# EAGLE design PCB3 (EAGLE 8.0.1)
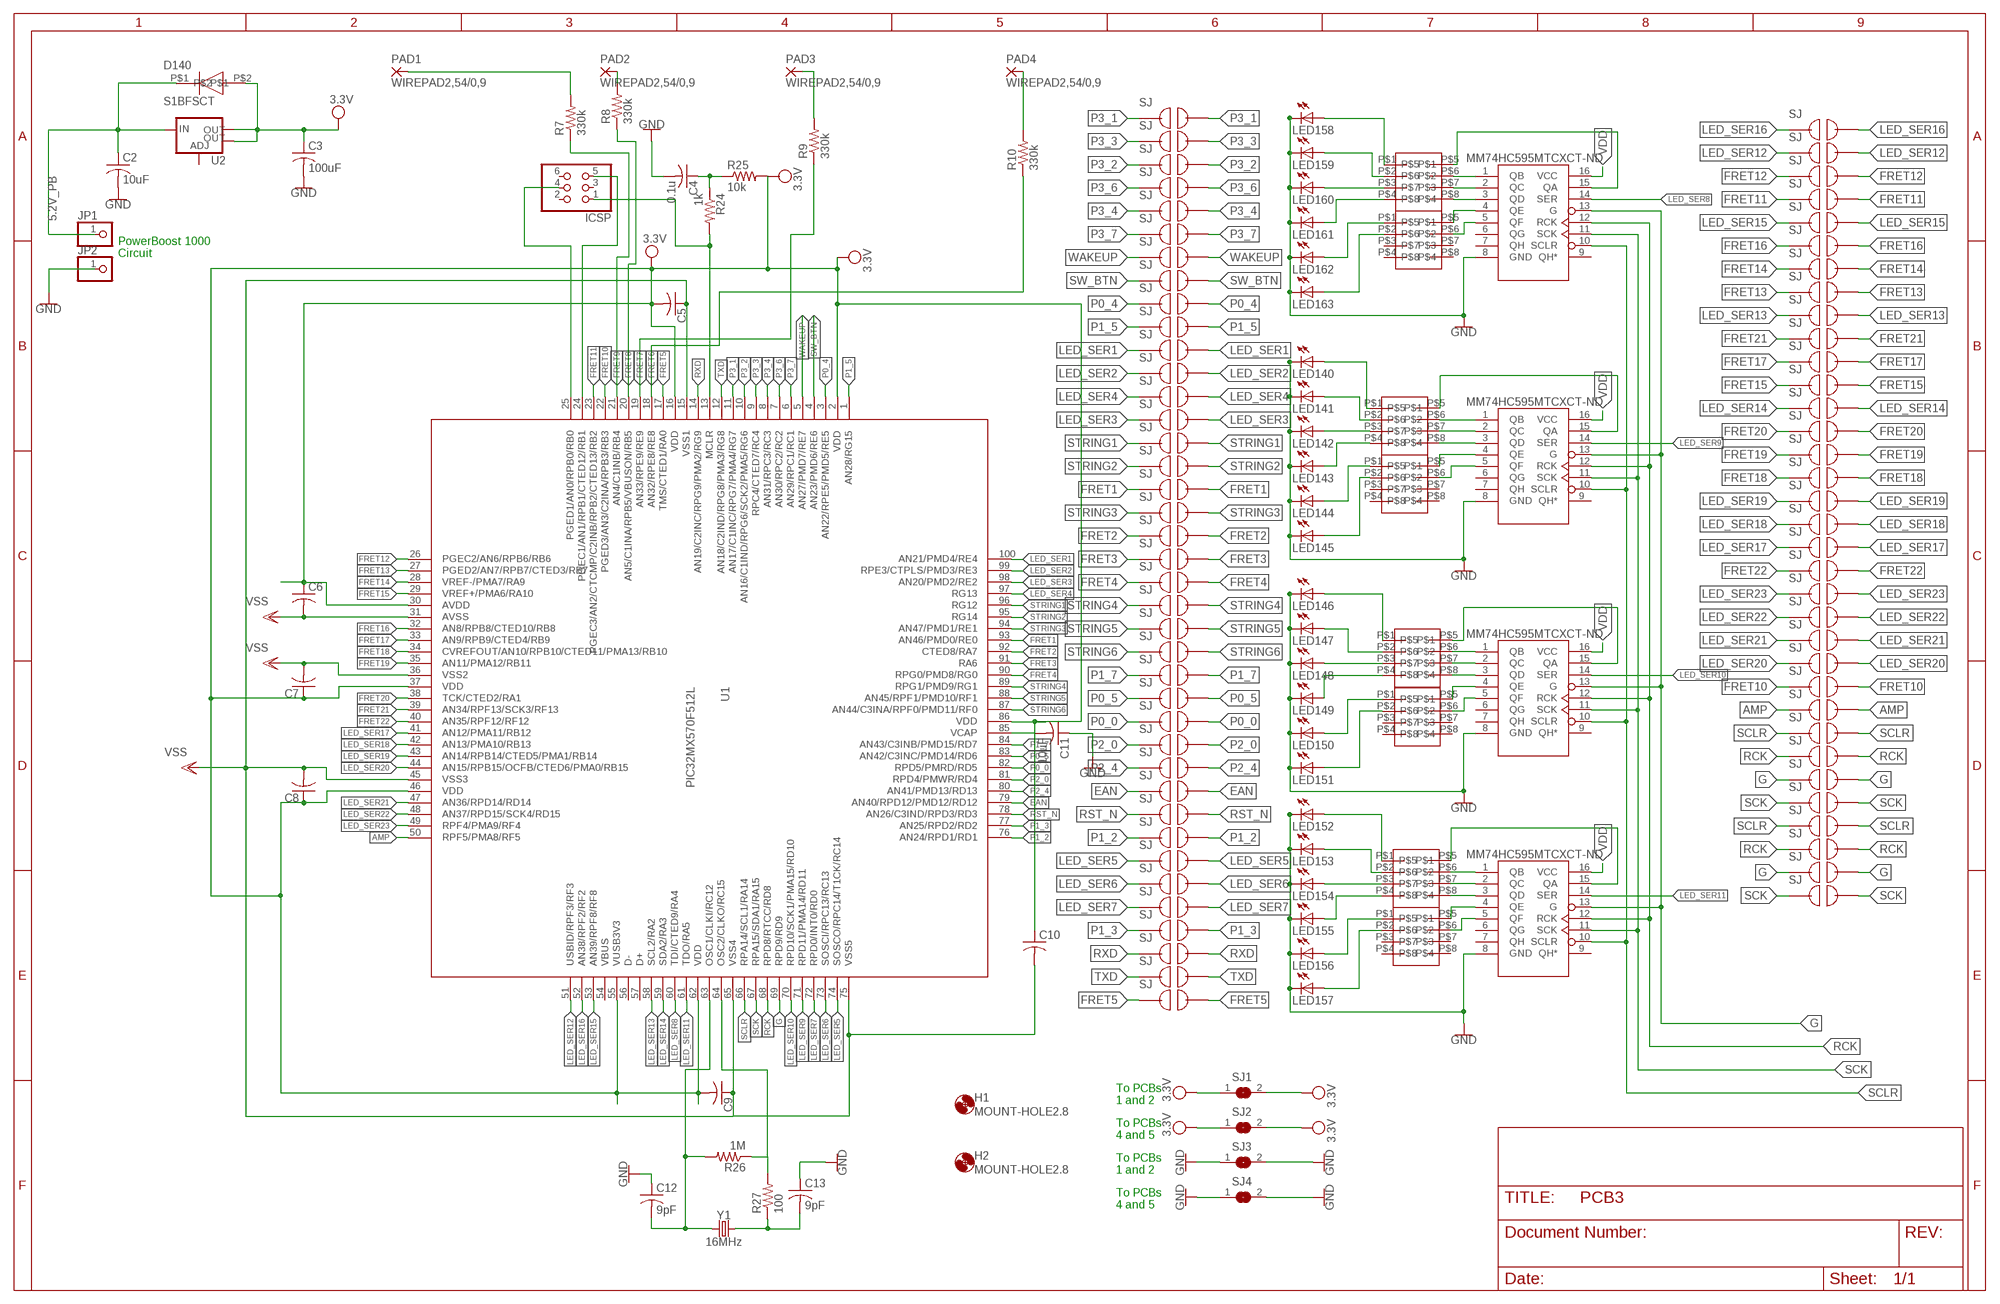
[diagram p0: schematic, sheet 1]

## Parts
C2  10uF  C-USC0805  [C0805]
C3  100uF  C-USC0805  [C0805]
C4  0.1u  C-USC0805  [C0805]
C5  C-USC0805  [C0805]
C6  C-USC0805  [C0805]
C7  C-USC0805  [C0805]
C8  C-USC0805  [C0805]
C9  C-USC0805  [C0805]
C10  C-USC0805  [C0805]
C11  10uF  C-USC0805  [C0805]
C12  9pF  C-USC0805  [C0805]
C13  9pF  C-USC0805  [C0805]
D140  S1BFSCT  [S1BFSCT]
H1  MOUNT-HOLE2.8  [2,8]
H2  MOUNT-HOLE2.8  [2,8]
ICSP  PINHD-2X3  [2X03]
JP1  PINHD-1X1  [1X01]
JP2  PINHD-1X1  [1X01]
LED140  LEDSMT1206  [1206]
LED141  LEDSMT1206  [1206]
LED142  LEDSMT1206  [1206]
LED143  LEDSMT1206  [1206]
LED144  LEDSMT1206  [1206]
LED145  LEDSMT1206  [1206]
LED146  LEDSMT1206  [1206]
LED147  LEDSMT1206  [1206]
LED148  LEDSMT1206  [1206]
LED149  LEDSMT1206  [1206]
LED150  LEDSMT1206  [1206]
LED151  LEDSMT1206  [1206]
LED152  LEDSMT1206  [1206]
LED153  LEDSMT1206  [1206]
LED154  LEDSMT1206  [1206]
LED155  LEDSMT1206  [1206]
LED156  LEDSMT1206  [1206]
LED157  LEDSMT1206  [1206]
LED158  LEDSMT1206  [1206]
LED159  LEDSMT1206  [1206]
LED160  LEDSMT1206  [1206]
LED161  LEDSMT1206  [1206]
LED162  LEDSMT1206  [1206]
LED163  LEDSMT1206  [1206]
PAD1  WIREPAD2,54/0,9  [2,54/0,9]
PAD2  WIREPAD2,54/0,9  [2,54/0,9]
PAD3  WIREPAD2,54/0,9  [2,54/0,9]
PAD4  WIREPAD2,54/0,9  [2,54/0,9]
R7  330k  R-US_M0805  [M0805]
R8  330k  R-US_M0805  [M0805]
R9  330k  R-US_M0805  [M0805]
R10  330k  R-US_M0805  [M0805]
R24  1k  R-US_M0805  [M0805]
R25  10k  R-US_M0805  [M0805]
R26  1M  R-US_M0805  [M0805]
R27  100  R-US_M0805  [M0805]
RXD  JUMPER  [JUMPER]
SJ1  SJW  [SJW]
SJ2  SJW  [SJW]
SJ3  SJW  [SJW]
SJ4  SJW  [SJW]
U1  PIC32MX570F512L  [TQFP100-14X14]
U2  V_REG_LM1117SOT223  [SOT223]
U$1  JUMPER  [JUMPER]
U$2  JUMPER  [JUMPER]
U$3  JUMPER  [JUMPER]
U$4  JUMPER  [JUMPER]
U$5  JUMPER  [JUMPER]
U$6  JUMPER  [JUMPER]
U$7  JUMPER  [JUMPER]
U$8  JUMPER  [JUMPER]
U$9  JUMPER  [JUMPER]
U$10  JUMPER  [JUMPER]
U$11  JUMPER  [JUMPER]
U$12  JUMPER  [JUMPER]
U$13  JUMPER  [JUMPER]
U$14  JUMPER  [JUMPER]
U$15  JUMPER  [JUMPER]
U$16  JUMPER  [JUMPER]
U$17  JUMPER  [JUMPER]
U$18  JUMPER  [JUMPER]
U$19  JUMPER  [JUMPER]
U$20  JUMPER  [JUMPER]
U$21  JUMPER  [JUMPER]
U$22  JUMPER  [JUMPER]
U$23  JUMPER  [JUMPER]
U$24  JUMPER  [JUMPER]
U$25  JUMPER  [JUMPER]
U$26  MM74HC595TSSOP-LD16  [MM74HC595MTCXCT-ND]
U$27  MM74HC595TSSOP-LD16  [MM74HC595MTCXCT-ND]
U$28  MM74HC595TSSOP-LD16  [MM74HC595MTCXCT-ND]
U$29  MM74HC595TSSOP-LD16  [MM74HC595MTCXCT-ND]
U$30  JUMPER  [JUMPER]
U$31  JUMPER  [JUMPER]
U$32  JUMPER  [JUMPER]
U$33  JUMPER  [JUMPER]
U$34  JUMPER  [JUMPER]
U$35  JUMPER  [JUMPER]
U$36  JUMPER  [JUMPER]
U$37  JUMPER  [JUMPER]
U$38  JUMPER  [JUMPER]
U$39  JUMPER  [JUMPER]
U$40  JUMPER  [JUMPER]
U$41  JUMPER  [JUMPER]
U$42  JUMPER  [JUMPER]
U$43  JUMPER  [JUMPER]
U$44  JUMPER  [JUMPER]
U$45  JUMPER  [JUMPER]
U$46  JUMPER  [JUMPER]
U$47  JUMPER  [JUMPER]
U$48  JUMPER  [JUMPER]
U$49  JUMPER  [JUMPER]
U$50  JUMPER  [JUMPER]
U$51  JUMPER  [JUMPER]
U$52  JUMPER  [JUMPER]
U$53  JUMPER  [JUMPER]
U$54  JUMPER  [JUMPER]
U$55  JUMPER  [JUMPER]
U$56  JUMPER  [JUMPER]
U$57  JUMPER  [JUMPER]
U$58  JUMPER  [JUMPER]
U$59  JUMPER  [JUMPER]
U$60  JUMPER  [JUMPER]
U$61  JUMPER  [JUMPER]
U$62  JUMPER  [JUMPER]
U$63  JUMPER  [JUMPER]
U$64  JUMPER  [JUMPER]
U$65  JUMPER  [JUMPER]
U$66  JUMPER  [JUMPER]
U$67  JUMPER  [JUMPER]
U$68  JUMPER  [JUMPER]
U$69  JUMPER  [JUMPER]
U$70  JUMPER  [JUMPER]
U$71  MNR04MRAPJ680  [MNR04]
U$72  MNR04MRAPJ680  [MNR04]
U$73  MNR04MRAPJ680  [MNR04]
U$74  MNR04MRAPJ680  [MNR04]
U$75  MNR04MRAPJ680  [MNR04]
U$76  MNR04MRAPJ680  [MNR04]
U$77  MNR04MRAPJ680  [MNR04]
U$78  MNR04MRAPJ680  [MNR04]
U$79  JUMPER  [JUMPER]
U$80  JUMPER  [JUMPER]
U$81  JUMPER  [JUMPER]
U$82  JUMPER  [JUMPER]
U$83  JUMPER  [JUMPER]
U$84  JUMPER  [JUMPER]
Y1  16MHz  CRYSTALSMD-5X3.2-2PAD  [CRYSTAL-SMD-5X3.2-2PAD]

## Nets
5.2V_PB: C2.1 D140.P$1 JP1.1 U2.3(IN)
AMP: U1.50(RPF5/PMA8/RF5) U$70.P$2
EAN: U1.79(AN40/RPD12/PMD12/RD12) U$35.P$2
FRET1: U1.93(AN46/PMD0/RE0) U$18.P$2
FRET2: U1.92(CTED8/RA7) U$20.P$2
FRET3: U1.91(RA6) U$21.P$2
FRET4: U1.90(RPG0/PMD8/RG0) U$22.P$2
FRET5: U1.17(TMS/CTED1/RA0) U$43.P$1 U$43.P$2
FRET6: R10.1 U1.18(AN32/RPE8/RE8)
FRET7: R9.1 U1.19(AN33/RPE9/RE9)
FRET8: R8.1 U1.20(AN5/C1INA/RPB5/VBUSON/RB5)
FRET9: R7.1 U1.21(AN4/C1INB/RB4)
FRET10: U1.22(PGED3/AN3/C2INA/RPB3/RB3) U$69.P$2
FRET11: U1.23(PGEC3/AN2/CTCMP/C2INB/RPB2/CTED13/RB2) U$48.P$2
FRET12: U1.26(PGEC2/AN6/RPB6/RB6) U$47.P$2
FRET13: U1.27(PGED2/AN7/RPB7/CTED3/RB7) U$52.P$2
FRET14: U1.28(VREF-/PMA7/RA9) U$51.P$2
FRET15: U1.29(VREF+/PMA6/RA10) U$56.P$2
FRET16: U1.32(AN8/RPB8/CTED10/RB8) U$50.P$2
FRET17: U1.33(AN9/RPB9/CTED4/RB9) U$55.P$2
FRET18: U1.34(CVREFOUT/AN10/RPB10/CTED11/PMA13/RB10) U$60.P$2
FRET19: U1.35(AN11/PMA12/RB11) U$59.P$2
FRET20: U1.38(TCK/CTED2/RA1) U$58.P$2
FRET21: U1.39(AN34/RPF13/SCK3/RF13) U$54.P$2
FRET22: U1.40(AN35/RPF12/RF12) U$64.P$2
G: U1.69(RPD9/RD9) U$26.13(G) U$27.13(G) U$28.13(G) U$29.13(G) U$80.P$2 U$84.P$2
GND: C2.2 C3.2 C4.2 C11.1 C12.1 C13.1 JP2.1 LED140.C LED141.C LED142.C LED143.C LED144.C LED145.C LED146.C LED147.C LED148.C LED149.C LED150.C LED151.C LED152.C LED153.C LED154.C LED155.C LED156.C LED157.C LED158.C LED159.C LED160.C LED161.C LED162.C LED163.C SJ3.1 SJ3.2 SJ4.1 SJ4.2 U$26.8(GND) U$27.8(GND) U$28.8(GND) U$29.8(GND)
LED_SER1: U1.100(AN21/PMD4/RE4) U$12.P$2
LED_SER2: U1.99(RPE3/CTPLS/PMD3/RE3) U$13.P$2
LED_SER3: U1.98(AN20/PMD2/RE2) U$15.P$2
LED_SER4: U1.97(RG13) U$14.P$2
LED_SER5: U1.74(SOSCO/RPC14/T1CK/RC14) U$38.P$2
LED_SER6: U1.73(SOSCI/RPC13/RC13) U$39.P$2
LED_SER7: U1.72(RPD0/INT0/RD0) U$40.P$2
LED_SER8: U1.60(TDI/CTED9/RA4) U$26.14(SER)
LED_SER9: U1.71(RPD11/PMA14/RD11) U$27.14(SER)
LED_SER10: U1.70(RPD10/SCK1/PMA15/RD10) U$28.14(SER)
LED_SER11: U1.61(TDO/RA5) U$29.14(SER)
LED_SER12: U1.51(USBID/RPF3/RF3) U$46.P$2
LED_SER13: U1.58(SCL2/RA2) U$53.P$2
LED_SER14: U1.59(SDA2/RA3) U$57.P$2
LED_SER15: U1.53(AN39/RPF8/RF8) U$49.P$2
LED_SER16: U1.52(AN38/RPF2/RF2) U$45.P$2
LED_SER17: U1.41(AN12/PMA11/RB12) U$63.P$2
LED_SER18: U1.42(AN13/PMA10/RB13) U$62.P$2
LED_SER19: U1.43(AN14/RPB14/CTED5/PMA1/RB14) U$61.P$2
LED_SER20: U1.44(AN15/RPB15/OCFB/CTED6/PMA0/RB15) U$68.P$2
LED_SER21: U1.47(AN36/RPD14/RD14) U$67.P$2
LED_SER22: U1.48(AN37/RPD15/SCK4/RD15) U$66.P$2
LED_SER23: U1.49(RPF4/PMA9/RF4) U$65.P$2
N$1: C4.1 R24.1 R25.1
N$2: ICSP.5 U1.24(PGEC1/AN1/RPB1/CTED12/RB1)
N$3: PAD1.1(P) R7.2
N$4: PAD2.1(P) R8.2
N$5: PAD3.1(P) R9.2
N$6: U$28.5(QF) U$76.P$6
N$7: PAD4.1(P) R10.2
N$8: LED146.A U$75.P$1
N$9: LED147.A U$75.P$2
N$10: LED148.A U$75.P$3
N$12: C11.2 U1.85(VCAP)
N$13: ICSP.1 R24.2 U1.13(MCLR)
N$14: ICSP.4 U1.25(PGED1/AN0/RPB0/RB0)
N$15: LED149.A U$75.P$4
N$17: LED150.A U$76.P$1
N$18: LED151.A U$76.P$2
N$19: U$27.1(QB) U$73.P$6
N$20: U$27.2(QC) U$73.P$7
N$21: U$27.3(QD) U$73.P$8
N$22: U$27.4(QE) U$74.P$5
N$23: U$27.5(QF) U$74.P$6
N$24: LED142.A U$73.P$3
N$26: U$26.1(QB) U$71.P$6
N$27: U$26.2(QC) U$71.P$7
N$28: U$26.3(QD) U$71.P$8
N$29: U$26.4(QE) U$72.P$5
N$30: U$26.5(QF) U$72.P$6
N$31: U$27.15(QA) U$73.P$5
N$32: LED140.A U$73.P$1
N$33: LED141.A U$73.P$2
N$34: LED160.A U$71.P$3
N$35: LED143.A U$73.P$4
N$36: U$29.1(QB) U$77.P$6
N$37: C13.2 R27.1 Y1.P$2
N$38: C12.2 R26.2 U1.63(OSC1/CLKI/RC12) Y1.P$1
N$39: U$29.2(QC) U$77.P$7
N$40: U$29.3(QD) U$77.P$8
N$41: U$29.4(QE) U$78.P$5
N$42: U$29.5(QF) U$78.P$6
N$43: LED153.A U$77.P$2
N$44: LED154.A U$77.P$3
N$45: LED155.A U$77.P$4
N$46: LED144.A U$74.P$1
N$47: LED145.A U$74.P$2
N$62: U$28.1(QB) U$75.P$6
N$63: U$28.2(QC) U$75.P$7
N$64: U$28.3(QD) U$75.P$8
N$74: U$28.4(QE) U$76.P$5
N$77: U$28.15(QA) U$75.P$5
N$96: U$29.15(QA) U$77.P$5
N$97: LED152.A U$77.P$1
N$100: LED156.A U$78.P$1
N$101: LED157.A U$78.P$2
N$125: U$26.15(QA) U$71.P$5
N$126: LED158.A U$71.P$1
N$134: LED161.A U$71.P$4
N$135: LED162.A U$72.P$1
N$136: LED163.A U$72.P$2
N$137: LED159.A U$71.P$2
OSC2: R26.1 R27.2 U1.64(OSC2/CLKO/RC15)
P0_0: U1.82(RPD5/PMRD/RD5) U$32.P$2
P0_4: U1.3(AN22/RPE5/PMD5/RE5) U$10.P$2
P0_5: U1.83(AN42/C3INC/PMD14/RD6) U$31.P$2
P1_2: U1.76(AN24/RPD1/RD1) U$37.P$2
P1_3: U1.77(AN25/RPD2/RD2) U$41.P$2
P1_5: U1.1(AN28/RG15) U$11.P$2
P1_7: U1.84(AN43/C3INB/PMD15/RD7) U$30.P$2
P2_0: U1.81(RPD4/PMWR/RD4) U$33.P$2
P2_4: U1.80(AN41/PMD13/RD13) U$34.P$2
P3_1: U1.11(AN17/C1INC/RPG7/PMA4/RG7) U$1.P$2
P3_2: U1.10(AN16/C1IND/RPG6/SCK2/PMA5/RG6) U$4.P$2
P3_3: U1.9(RPC4/CTED7/RC4) U$3.P$2
P3_4: U1.8(AN31/RPC3/RC3) U$6.P$2
P3_6: U1.7(AN30/RPC2/RC2) U$5.P$2
P3_7: U1.6(AN29/RPC1/RC1) U$7.P$2
RCK: U1.68(RPD8/RTCC/RD8) U$26.12(RCK) U$27.12(RCK) U$28.12(RCK) U$29.12(RCK) U$79.P$2 U$83.P$2
RST_N: U1.78(AN26/C3IND/RPD3/RD3) U$36.P$2
RXD: RXD.P$1 RXD.P$2 U1.14(AN19/C2INC/RPG9/PMA2/RG9)
SCK: U1.67(RPA15/SDA1/RA15) U$26.11(SCK) U$27.11(SCK) U$28.11(SCK) U$29.11(SCK) U$42.P$1 U$42.P$2 U$81.P$1 U$81.P$2
SCLR: U1.66(RPA14/SCL1/RA14) U$2.P$2 U$26.10(SCLR) U$27.10(SCLR) U$28.10(SCLR) U$29.10(SCLR) U$82.P$2
STRING1: U1.96(RG12) U$16.P$2
STRING2: U1.95(RG14) U$17.P$2
STRING3: U1.94(AN47/PMD1/RE1) U$19.P$2
STRING4: U1.89(RPG1/PMD9/RG1) U$23.P$2
STRING5: U1.88(AN45/RPF1/PMD10/RF1) U$24.P$2
STRING6: U1.87(AN44/C3INA/RPF0/PMD11/RF0) U$25.P$2
SW_BTN: U1.4(AN23/PMD6/RE6) U$9.P$2
TXD: U1.12(AN18/C2IND/RPG8/PMA3/RG8) U$44.P$1 U$44.P$2
VDD: C3.1 C5.2 C6.1 C7.1 C8.1 C9.2 C10.1 D140.P$2 R25.2 SJ1.1 SJ1.2 SJ2.1 SJ2.2 U1.2(VDD) U1.16(VDD) U1.30(AVDD) U1.37(VDD) U1.46(VDD) U1.55(VUSB3V3) U1.62(VDD) U1.86(VDD) U2.2(OUT) U2.4(OUT) U$26.16(VCC) U$27.16(VCC) U$28.16(VCC) U$29.16(VCC) ; supply symbol labelled 3.3V
VSS: C5.1 C6.2 C7.2 C8.2 C9.1 C10.2 U1.15(VSS1) U1.31(AVSS) U1.36(VSS2) U1.45(VSS3) U1.65(VSS4) U1.75(VSS5)
WAKEUP: U1.5(AN27/PMD7/RE7) U$8.P$2
Unconnected: ICSP.2 ICSP.3 ICSP.6 U1.54(VBUS) U1.56(D-) U1.57(D+) U2.1(ADJ) U$1.P$1 U$2.P$1 U$3.P$1 U$4.P$1 U$5.P$1 U$6.P$1 U$7.P$1 U$8.P$1 U$9.P$1 U$10.P$1 U$11.P$1 U$12.P$1 U$13.P$1 U$14.P$1 U$15.P$1 U$16.P$1 U$17.P$1 U$18.P$1 U$19.P$1 U$20.P$1 U$21.P$1 U$22.P$1 U$23.P$1 U$24.P$1 U$25.P$1 U$26.6(QG) U$26.7(QH) U$26.9(QH*) U$27.6(QG) U$27.7(QH) U$27.9(QH*) U$28.6(QG) U$28.7(QH) U$28.9(QH*) U$29.6(QG) U$29.7(QH) U$29.9(QH*) U$30.P$1 U$31.P$1 U$32.P$1 U$33.P$1 U$34.P$1 U$35.P$1 U$36.P$1 U$37.P$1 U$38.P$1 U$39.P$1 U$40.P$1 U$41.P$1 U$45.P$1 U$46.P$1 U$47.P$1 U$48.P$1 U$49.P$1 U$50.P$1 U$51.P$1 U$52.P$1 U$53.P$1 U$54.P$1 U$55.P$1 U$56.P$1 U$57.P$1 U$58.P$1 U$59.P$1 U$60.P$1 U$61.P$1 U$62.P$1 U$63.P$1 U$64.P$1 U$65.P$1 U$66.P$1 U$67.P$1 U$68.P$1 U$69.P$1 U$70.P$1 U$72.P$3 U$72.P$4 U$72.P$7 U$72.P$8 U$74.P$3 U$74.P$4 U$74.P$7 U$74.P$8 U$76.P$3 U$76.P$4 U$76.P$7 U$76.P$8 U$78.P$3 U$78.P$4 U$78.P$7 U$78.P$8 U$79.P$1 U$80.P$1 U$82.P$1 U$83.P$1 U$84.P$1

## Notes on the sheet
- PowerBoost 1000
  Circuit
- To PCBs
  1 and 2
- To PCBs
  4 and 5
- To PCBs
  1 and 2
- To PCBs
  4 and 5

## Library data of the parts
C2-C13 = rcl:C-US: CAPACITOR, American symbol
D140 = ECE477_Guitutar:S1BFSCT
H1 H2 = holes:MOUNT-HOLE: MOUNTING HOLE with drill center marker
ICSP = pinhead:PINHD-2X3: PIN HEADER
JP1 JP2 = pinhead:PINHD-1X1: PIN HEADER
LED140-LED163 = led:LED: LED OSRAM: - CHIPLED LG R971, LG N971, LY N971, LG Q971, LY Q971, LO R971, LY R971 LH N974, LH R974 LS Q976, LO Q976, LY Q976 LO Q996 - Hyper CHIPLED LW Q18S LB Q993, LB Q99A, LB R99A - SideLED LS A670, LO A670, LY A670, LG A670, LP A670 LB A673, LV A673, LT A673, LW A673 LH A674 LY A675 LS A676, LA A676, LO A676, LY A676, LW A676 LS A679, LY A679, LG A679 - Hyper Micro SIDELED® LS Y876, LA Y876, LO Y876, LY Y876 LT Y87S - SmartLED LW L88C, LW L88S LB L89C, LB L89S, LG L890 LS L89K, LO L89K, LY L89K LS L896, LA L896, LO L896, LY L896 - TOPLED LS T670, LO T670, LY T670, LG T670, LP T670 LSG T670, LSP T670, LSY T670, LOP T670, LYG T670 LG T671, LOG T671, LSG T671 LB T673, LV T673, LT T673, LW T673 LH T674 LS T676, LA T676, LO T676, LY T676, LB T676, LH T676, LSB T676, LW T676 LB T67C, LV T67C, LT T67C, LS T67K, LO T67K, LY T67K, LW E67C LS E67B, LA E67B, LO E67B, LY E67B, LB E67C, LV E67C, LT E67C LW T67C LS T679, LY T679, LG T679 LS T770, LO T770, LY T770, LG T770, LP T770 LB T773, LV T773, LT T773, LW T773 LH T774 LS E675, LA E675, LY E675, LS T675 LS T776, LA T776, LO T776, LY T776, LB T776 LHGB T686 LT T68C, LB T68C - Hyper Mini TOPLED® LB M676 - Mini TOPLED Santana® LG M470 LS M47K, LO M47K, LY M47K Source: http://www.osram.convergy.de LUXEON: - LUMILED® LXK2-PW12-R00, LXK2-PW12-S00, LXK2-PW14-U00, LXK2-PW14-V00 LXK2-PM12-R00, LXK2-PM12-S00, LXK2-PM14-U00 LXK2-PE12-Q00, LXK2-PE12-R00, LXK2-PE12-S00, LXK2-PE14-T00, LXK2-PE14-U00 LXK2-PB12-K00, LXK2-PB12-L00, LXK2-PB12-M00, LXK2-PB14-N00, LXK2-PB14-P00, LXK2-PB14-Q00 LXK2-PR12-L00, LXK2-PR12-M00, LXK2-PR14-Q00, LXK2-PR14-R00 LXK2-PD12-Q00, LXK2-PD12-R00, LXK2-PD12-S00 LXK2-PH12-R00, LXK2-PH12-S00 LXK2-PL12-P00, LXK2-PL12-Q00, LXK2-PL12-R00 Source: www.luxeon.com KINGBRIGHT: KA-3528ASYC Source: www.kingbright.com
PAD1-PAD4 = wirepad:WIREPAD: Wire PAD connect wire on PCB
R7-R10 R24-R27 = rcl:R-US_: RESISTOR, American symbol
RXD U$1-U$25 U$30-U$70 U$79-U$84 = ECE477_Guitutar:JUMPER
SJ1-SJ4 = jumper:SJ: SMD solder JUMPER
U1 = ECE477_Guitutar:PIC32MX570F512L
U2 = SparkFun-IC-Power:V_REG_LM1117: Voltage Regulator LM1117 Standard adjustable voltage regulator but in SMD form. Spark Fun Electronics SKU : COM-00595; PROD_ID: VREG-08170
U$26-U$29 = ECE477_Guitutar:MM74HC595
U$71-U$78 = ECE477_Guitutar:MNR04MRAPJ680
Y1 = SparkFun-Clocks:CRYSTAL: Crystals (Generic) These are passive quartz crystals, which can be used as a clock source for a microcontroller. Crystal's are two-terminal devices. They require external "load" capacitors to generate an oscillating signal.

## Board
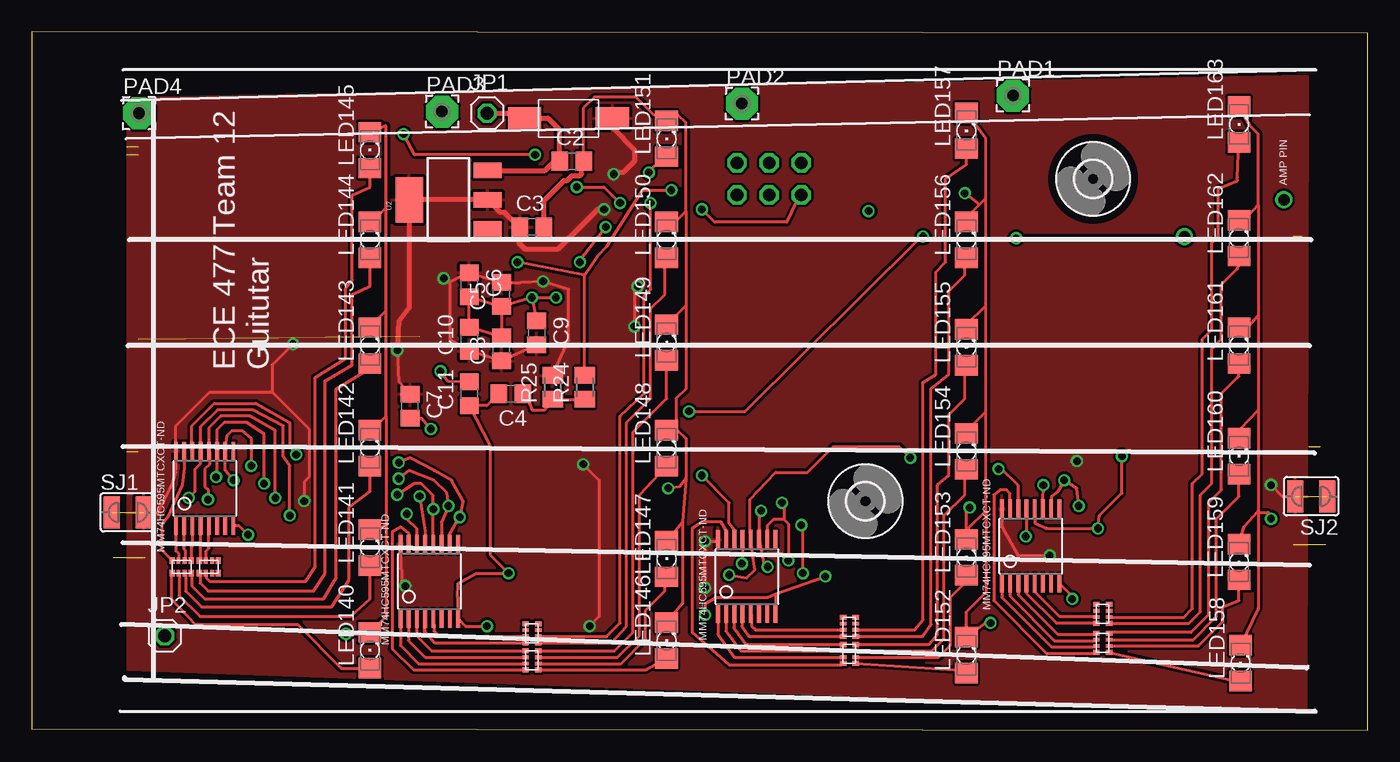
[diagram p1: board, top side]
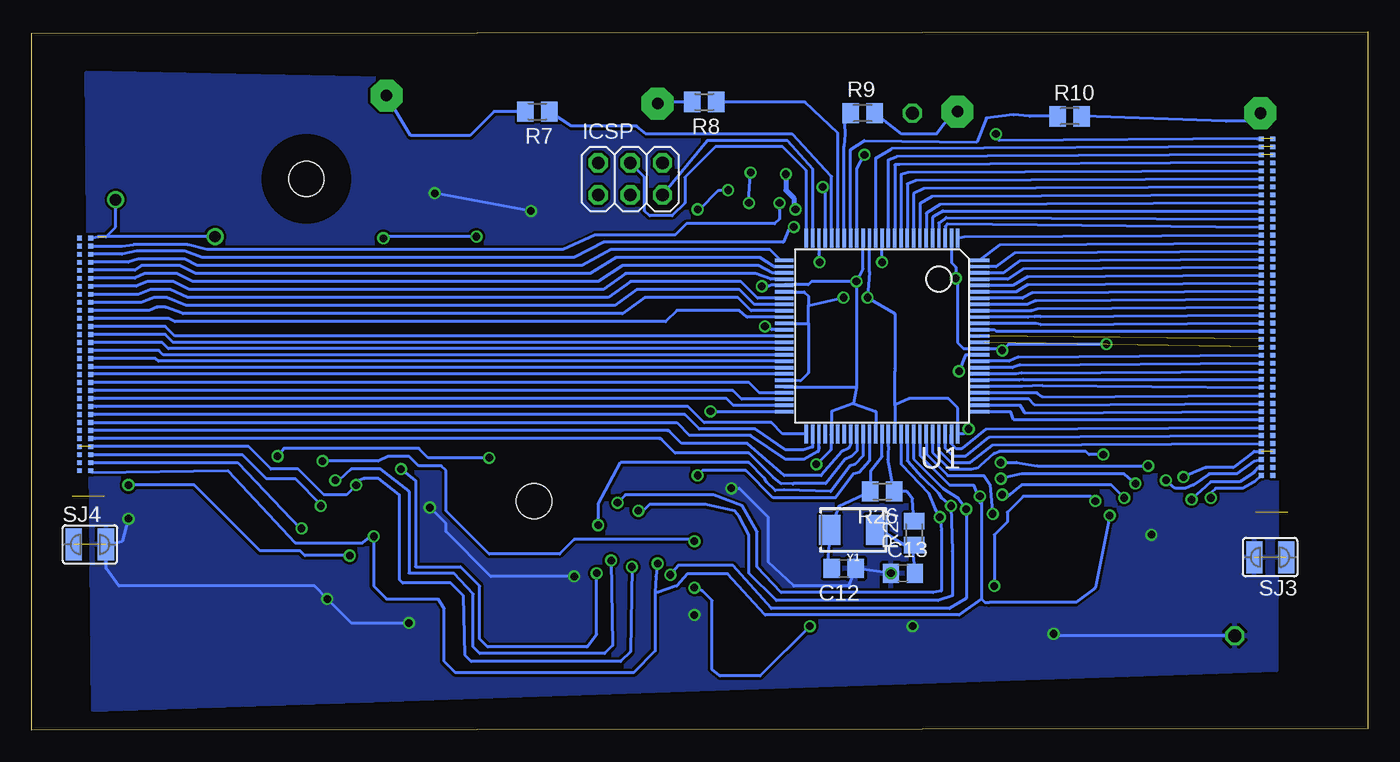
[diagram p2: board, bottom side, seen from below]

Size 105.84 x 55.36 mm. Coordinates in mm from the lower left corner, seen from the top.
Outline: 0,0.13 105.84,0 105.84,55.23 0,55.36 0,0.13
Copper layers (1*16): Top 0.0356mm / dielectric 1.5011mm / Bottom 0.0356mm
Design rules "ECE_Senior_Design": minimum track width 8mil, minimum drill 13mil, track to track 8mil, track to pad 8mil, pad to pad 6mil, via to via 8mil, smd to smd 6mil, copper to edge 15mil, drill to drill 8mil, minimum pad ring 7mil, minimum via ring 7mil, stop-mask expansion 3mil, vias tented up to drill 0mil, thermal gap 10mil

### Footprints (pad centres in the part's own frame; a part is rotated, then mirrored left to right if it is on the bottom)
C0805 = smd 1.3 x 1.5: 1 -0.95,0; 2 0.95,0
S1BFSCT = smd 2.65 x 1.75: P$1 -3.5,0; P$2 3.45,0
2,8 = hole 2.8: 0,0
2X03 = drill 1.016 octagon: 1 -2.54,-1.27; 2 -2.54,1.27; 3 0,-1.27; 4 0,1.27; 5 2.54,-1.27; 6 2.54,1.27
1X01 = drill 1.016 octagon: 1 0,0
1206 = smd 1.6 x 1.803: A -1.422,0; C 1.422,0
2,54/0,9 = drill 0.914 pad 2.54 octagon: 1 0,0
M0805 = smd 1.3 x 1.6: 1 -0.95,0; 2 0.95,0
JUMPER = smd 0.381 x 0.381: P$1 -0.454,0; P$2 0.454,0
SJW = smd 1.27 x 2.54: 1 -1.27,0; 2 1.27,0
TQFP100-14X14 = smd 0.27 x 1.5: 1 -6,-7.75; 2 -5.5,-7.75; 3 -5,-7.75; 4 -4.5,-7.75; 5 -4,-7.75; 6 -3.5,-7.75; 7 -3,-7.75; 8 -2.5,-7.75; 9 -2,-7.75; 10 -1.5,-7.75; 11 -1,-7.75; 12 -0.5,-7.75; 13 0,-7.75; 14 0.5,-7.75; 15 1,-7.75; 16 1.5,-7.75; 17 2,-7.75; 18 2.5,-7.75; 19 3,-7.75; 20 3.5,-7.75; 21 4,-7.75; 22 4.5,-7.75; 23 5,-7.75; 24 5.5,-7.75; 25 6,-7.75; 51 6,7.75; 52 5.5,7.75; 53 5,7.75; 54 4.5,7.75; 55 4,7.75; 56 3.5,7.75; 57 3,7.75; 58 2.5,7.75; 59 2,7.75; 60 1.5,7.75; 61 1,7.75; 62 0.5,7.75; 63 0,7.75; 64 -0.5,7.75; 65 -1,7.75; 66 -1.5,7.75; 67 -2,7.75; 68 -2.5,7.75; 69 -3,7.75; 70 -3.5,7.75; 71 -4,7.75; 72 -4.5,7.75; 73 -5,7.75; 74 -5.5,7.75; 75 -6,7.75 | smd 1.5 x 0.27: 26 7.75,-6; 27 7.75,-5.5; 28 7.75,-5; 29 7.75,-4.5; 30 7.75,-4; 31 7.75,-3.5; 32 7.75,-3; 33 7.75,-2.5; 34 7.75,-2; 35 7.75,-1.5; 36 7.75,-1; 37 7.75,-0.5; 38 7.75,0; 39 7.75,0.5; 40 7.75,1; 41 7.75,1.5; 42 7.75,2; 43 7.75,2.5; 44 7.75,3; 45 7.75,3.5; 46 7.75,4; 47 7.75,4.5; 48 7.75,5; 49 7.75,5.5; 50 7.75,6; 76 -7.75,6; 77 -7.75,5.5; 78 -7.75,5; 79 -7.75,4.5; 80 -7.75,4; 81 -7.75,3.5; 82 -7.75,3; 83 -7.75,2.5; 84 -7.75,2; 85 -7.75,1.5; 86 -7.75,1; 87 -7.75,0.5; 88 -7.75,0; 89 -7.75,-0.5; 90 -7.75,-1; 91 -7.75,-1.5; 92 -7.75,-2; 93 -7.75,-2.5; 94 -7.75,-3; 95 -7.75,-3.5; 96 -7.75,-4; 97 -7.75,-4.5; 98 -7.75,-5; 99 -7.75,-5.5; 100 -7.75,-6
SOT223 = smd 1.219 x 2.235: 1 -2.311,-3.099; 2 0,-3.099; 3 2.311,-3.099 | smd 3.6 x 2.2: 4 0,3.099
MM74HC595MTCXCT-ND = smd 0.3 x 1.45: 1 -2.275,-2.95; 2 -1.625,-2.95; 3 -0.975,-2.95; 4 -0.325,-2.95; 5 0.325,-2.95; 6 0.975,-2.95; 7 1.625,-2.95; 8 2.275,-2.95; 9 2.275,2.95; 10 1.625,2.95; 11 0.975,2.95; 12 0.325,2.95; 13 -0.325,2.95; 14 -0.975,2.95; 15 -1.625,2.95; 16 -2.275,2.95
MNR04 = smd 0.4 x 0.5: P$1 -0.8,-0.5; P$4 0.7,-0.5; P$5 -0.8,0.5; P$8 0.7,0.5 | smd 0.3 x 0.5: P$2 -0.3,-0.5; P$3 0.2,-0.5; P$6 -0.3,0.5; P$7 0.2,0.5
CRYSTAL-SMD-5X3.2-2PAD = smd 1.7 x 2.4: P$1 1.85,0; P$2 -1.85,0

### Placement (x,y rotation side)
C2  42.8,45.09 0 top
C3  39.62,39.88 0 top
C4  37.97,26.67 180 top
C5  37.21,34.54 90 top
C6  34.67,35.31 270 top
C7  29.97,25.68 270 top
C8  37.21,30.23 90 top
C9  40.01,31.5 270 top
C10  34.67,30.99 90 top
C11  34.67,26.67 90 top
C12  41.53,12.83 180 bottom
C13  36.83,12.45 0 bottom
D140  42.55,48.51 0 top
H1  84.07,43.69 0 top
H2  66.04,18.16 0 top
ICSP  58.42,43.69 0 bottom
JP1  36.07,48.9 0 top
JP2  10.54,7.49 0 top
LED140  26.8,6.35 90 top
LED141  26.8,14.48 90 top
LED142  26.8,22.35 90 top
LED143  26.8,30.48 90 top
LED144  26.8,38.86 90 top
LED145  26.8,45.97 90 top
LED146  50.29,7.11 90 top
LED147  50.29,13.59 90 top
LED148  50.29,22.35 90 top
LED149  50.29,30.73 90 top
LED150  50.29,38.86 90 top
LED151  50.29,46.86 90 top
LED152  74.04,5.97 90 top
LED153  74.04,13.72 90 top
LED154  74.04,22.1 90 top
LED155  74.04,30.35 90 top
LED156  74.04,38.86 90 top
LED157  74.04,47.5 90 top
LED158  95.76,5.33 90 top
LED159  95.63,13.34 90 top
LED160  95.63,21.72 90 top
LED161  95.63,30.48 90 top
LED162  95.63,38.99 90 top
LED163  95.63,48.01 90 top
PAD1  77.72,50.29 0 top
PAD2  56.26,49.66 0 top
PAD3  32.51,49.02 0 top
PAD4  8.51,48.9 0 top
R7  65.79,49.02 180 bottom
R8  52.58,49.78 180 bottom
R9  40.01,48.9 0 bottom
R10  23.62,48.64 0 bottom
R24  43.81,27.18 90 top
R25  41.27,27.18 90 top
R26  38.48,18.92 180 bottom
R27  35.94,15.62 90 bottom
RXD  8,46.23 0 bottom
SJ1  7.62,17.27 0 top
SJ2  101.35,18.54 180 top
SJ3  7.75,13.72 180 bottom
SJ4  101.22,14.73 0 bottom
U1  38.48,31.24 180 bottom
U2  33.02,42.04 90 top
U$1  8,44.96 180 bottom
U$2  8,21.46 180 bottom
U$3  8,43.69 180 bottom
U$4  8,44.32 180 bottom
U$5  8,42.42 180 bottom
U$6  8,43.05 180 bottom
U$7  8,41.78 180 bottom
U$8  8,41.15 180 bottom
U$9  8,40.51 180 bottom
U$10  8,39.88 180 bottom
U$11  8,39.24 180 bottom
U$12  8,38.61 180 bottom
U$13  8,37.97 180 bottom
U$14  8,36.7 180 bottom
U$15  8,37.34 180 bottom
U$16  8,36.07 180 bottom
U$17  8,35.43 180 bottom
U$18  8,34.16 180 bottom
U$19  8,34.8 180 bottom
U$20  8,33.53 180 bottom
U$21  8,32.89 180 bottom
U$22  8,32.26 180 bottom
U$23  8,31.62 180 bottom
U$24  8,30.99 180 bottom
U$25  8,30.35 180 bottom
U$26  79.12,14.61 0 top
U$27  13.72,19.18 0 top
U$28  31.5,11.81 0 top
U$29  56.64,12.19 0 top
U$30  8,29.72 180 bottom
U$31  8,29.08 180 bottom
U$32  8,28.45 180 bottom
U$33  8,27.81 180 bottom
U$34  8,27.18 180 bottom
U$35  8,26.54 180 bottom
U$36  8,25.91 180 bottom
U$37  8,24.64 180 bottom
U$38  8,24 180 bottom
U$39  8,23.37 180 bottom
U$40  8,22.73 180 bottom
U$41  8,25.27 180 bottom
U$42  8,22.1 0 bottom
U$43  8,46.86 0 bottom
U$44  8,45.59 0 bottom
U$45  101.6,25.02 0 bottom
U$46  101.6,25.65 0 bottom
U$47  101.6,37.08 0 bottom
U$48  101.6,37.72 0 bottom
U$49  101.6,24.38 0 bottom
U$50  101.6,34.54 0 bottom
U$51  101.6,35.81 0 bottom
U$52  101.6,36.45 0 bottom
U$53  101.6,23.75 0 bottom
U$54  101.6,31.37 0 bottom
U$55  101.6,33.91 0 bottom
U$56  101.6,35.18 0 bottom
U$57  101.6,23.11 0 bottom
U$58  101.6,32 0 bottom
U$59  101.6,32.64 0 bottom
U$60  101.6,33.27 0 bottom
U$61  101.6,28.83 0 bottom
U$62  101.6,29.46 0 bottom
U$63  101.6,30.1 0 bottom
U$64  101.6,30.73 0 bottom
U$65  101.6,26.29 0 bottom
U$66  101.6,26.92 0 bottom
U$67  101.6,27.56 0 bottom
U$68  101.6,28.19 0 bottom
U$69  101.6,38.35 0 bottom
U$70  101.6,38.99 0 bottom
U$71  84.84,6.98 90 top
U$72  84.84,9.27 90 top
U$73  11.94,12.95 0 top
U$74  14.1,12.95 0 top
U$75  39.62,5.59 90 top
U$76  39.62,7.75 90 top
U$77  64.77,6.1 90 top
U$78  64.77,8.26 90 top
U$79  8,20.83 180 bottom
U$80  8,20.19 180 bottom
U$81  101.6,22.48 0 bottom
U$82  101.6,21.84 0 bottom
U$83  101.6,21.21 0 bottom
U$84  101.6,20.57 0 bottom
Y1  40.77,15.88 180 bottom

### Tracks (layer width: path | path; a pad name or v marks a point on that pad's centre or on a via)
5.2V_PB
  Top 0.406: U2.3 40.66,44.35 41.4,45.09 C2.1 41.78,45.15 41.78,47.62 40.89,48.51 D140.P$1 38.66,48.9 JP1.1
AMP  (via drill 0.6, 0.9 pad 1.27)  (1 unrouted)
  Top 0.254: v52.07,25.27 56.52,25.27 70.36,38.99 70.48,38.99 v70.61,39.12 | v77.98,38.99 91.06,38.99 v91.31,39.12
  Bottom 0.254: U1.50 51.78,25.24 v52.07,25.27 | v70.61,39.12 77.85,39.12 v77.98,38.99 | v91.31,39.12 100.58,39.12 101.09,38.99 U$70.P$2 | 99.95,39.12 99.19,39.88 v99.19,42.04
EAN
  Bottom 0.254: U1.79 26.22,26.74 25.78,26.42 8.51,26.54 U$35.P$2
FRET1
  Bottom 0.254: U1.93 26.96,33.74 26.29,34.04 8.51,34.16 U$18.P$2
FRET2
  Bottom 0.254: U1.92 30.7,33.27 26.67,33.27 26.16,33.4 8.51,33.53 U$20.P$2
FRET3
  Bottom 0.254: U1.91 26.9,32.74 26.42,32.77 25.91,32.77 8.51,32.89 U$21.P$2
FRET4
  Bottom 0.254: U1.90 26.27,32.24 25.91,32.13 8.51,32.26 U$22.P$2
FRET5  (via drill 0.6)  (1 unrouted)
  Top 0.254: v39.88,45.59 30.35,45.59 v29.46,47.24
  Bottom 0.254: U1.17 40.48,44.48 v39.88,45.59 | v29.46,47.24 29.21,46.74 8.76,46.86 U$43.P$1
FRET6
  Bottom 0.254: U1.18 40.98,46.01 39.88,46.74 30.99,46.61 30.23,48.51 28.07,48.77 26.8,48.64 R10.1
FRET7
  Bottom 0.254: U1.19 41.48,46.28 41.4,47.24 41.46,48.07 R9.1
FRET8
  Bottom 0.254: U1.20 41.98,47.32 44.58,49.78 R8.1
FRET9
  Bottom 0.254: U1.21 42.48,43.88 45.59,47.24 57.15,47.24 57.91,47.88 63.06,47.88 R7.1
FRET10  (via drill 0.6)
  Top 0.254: v43.18,43.05 45.34,43.05 v46.61,41.78
  Bottom 0.254: U1.22 42.98,42.85 v43.18,43.05 | v46.61,41.78 46.61,40.51 46.99,40.13 53.98,40.13 54.86,39.24 61.21,39.24 63.75,38.1 91.95,38.1 93.47,38.48 97.79,38.48 98.68,38.35 U$69.P$2
FRET11  (via drill 0.6)
  Top 0.254: v43.43,37.08 43.81,37.72 v45.47,39.88
  Bottom 0.254: U1.23 43.48,37.77 v43.43,37.08 | v45.47,39.88 45.85,39.75 46.29,38.67 60.52,38.67 62.87,37.47 92.33,37.47 93.73,37.97 97.54,37.97 98.68,37.72 U$48.P$2
FRET12
  Bottom 0.254: U1.26 46.51,37.24 47.37,38.1 59.94,38.1 62.23,36.83 92.71,36.83 93.73,37.34 97.41,37.34 98.17,37.08 U$47.P$2
FRET13
  Bottom 0.254: U1.27 47.03,36.74 48.13,37.47 59.56,37.47 61.59,36.2 92.84,36.2 94.11,36.83 97.16,36.83 97.66,36.45 U$52.P$2
FRET14
  Bottom 0.254: U1.28 47.16,36.24 48.26,36.83 59.05,36.83 60.96,35.56 93.09,35.56 94.36,36.2 96.9,36.2 97.66,35.81 U$51.P$2
FRET15
  Bottom 0.254: U1.29 47.3,35.74 48.51,36.2 58.8,36.2 60.58,34.93 93.34,34.93 94.61,35.56 96.65,35.56 97.54,35.18 U$56.P$2
FRET16
  Bottom 0.254: U1.32 48.34,34.24 49.66,35.56 58.42,35.56 60.2,34.29 93.47,34.29 94.87,34.93 96.39,34.93 97.41,34.54 U$50.P$2
FRET17
  Bottom 0.254: U1.33 48.6,33.74 49.78,34.93 57.91,34.93 59.69,33.66 93.6,33.66 95.12,34.29 96.14,34.29 97.16,33.91 U$55.P$2
FRET18
  Bottom 0.254: U1.34 48.86,33.24 49.91,34.29 57.28,34.29 59.05,33.02 93.85,33.02 95.25,33.53 95.89,33.53 96.52,33.27 U$60.P$2
FRET19
  Bottom 0.254: U1.35 49.17,32.74 49.78,33.27 54.74,33.27 55.63,32.39 94.49,32.39 95,32.64 U$59.P$2
FRET20
  Bottom 0.254: U$58.P$2 95.25,32 94.49,31.24 U1.38
FRET21
  Bottom 0.254: U$54.P$2 95.26,31.36 94.64,30.74 U1.39
FRET22
  Bottom 0.254: U$64.P$2 95.5,30.73 95.01,30.24 U1.40
G  (via drill 0.6)
  Top 0.254: v30.73,18.54 31.17,15.75 U$28.13 | v20.45,17.02 20.45,20.95 19.94,21.72 19.94,24.13 17.53,25.4 14.73,25.4 13.39,24.06 U$27.13 13.39,21.14 12.95,20.7 12.95,18.92 v12.45,18.41 | U$29.13 56.32,13.66 v56.26,13.21 | U$26.13 78.8,15.42 v78.74,15.37
  Bottom 0.254: v20.45,17.02 21.59,11.3 23.11,10.16 29.97,10.16 | v56.26,13.21 56.39,12.19 56.46,10.94 | U1.69 35.48,21.77 33.15,19.43 31.24,19.43 30.73,18.16 v30.73,18.54 | 29.97,10.16 30.02,10.11 | 30.68,17.96 v30.73,18.54 | 56.46,10.94 56.22,10.94 54.86,11.41 54.74,11.43 53.88,12.41 50.71,12.41 47.75,9.14 32.38,9.14 30.61,10.41 | v30.73,18.54 30.61,18.41 30.61,10.41 | 30.61,10.41 30.35,10.16 29.97,10.16 | 56.46,10.94 56.46,6.28 58.17,4.57 72.26,4.57 73.15,5.46 73.15,9.65 73.66,10.41 77.72,10.41 78.74,11.43 v78.74,15.37 78.99,15.37 79.63,14.86 84.96,14.86 90.3,20.57 101.02,20.45 U$84.P$2 | U$80.P$2 9.02,19.68 9.91,19.18 12.06,19.18 12.45,18.8 v12.45,18.41
GND  (via drill 0.6)  (2 unrouted)
  Top 0.254: C4.2 36.07,25.72 C11.1 36.32,22.54 36.32,13.9 C13.1 35.21,12.45 33.78,11.66 33.74,10.54 U$28.8 34.38,8.26 v36.07,8.26 | 50.39,23.88 LED148.C | U$27.8 16.41,16.23 v17.14,15.49 | U$29.8 58.9,9.62 58.93,10.79 | 58.93,10.79 v62.87,12.19 | v24.89,7.64 26.67,7.64 LED140.C 28.07,9.04 28.07,16.38 | 28.07,33.27 28.07,41.4 | 28.07,24.89 28.07,33.27 | 28.07,24.89 28.07,16.38 | 28.07,41.4 28.07,47.9 LED145.C | LED144.C 26.95,40.28 28.07,41.4 | LED143.C 26.8,32 28.07,33.27 | LED142.C 26.82,23.65 28.07,24.89 | LED141.C 27.08,15.39 28.07,16.38 | 51.82,19.94 51.82,23.11 51.16,23.77 LED148.C | 51.82,19.94 51.56,16.51 | 51.82,33.66 51.82,27.05 51.05,26.29 51.05,24.54 LED148.C | 51.82,41.15 51.82,33.66 | 51.82,41.15 51.82,48.13 51.16,48.79 LED151.C 49.25,48.79 47.88,50.16 44.58,50.16 43.69,49.28 43.69,45.15 C2.2 | 51.56,16.51 51.56,10.06 LED146.C | LED147.C 50.32,15.01 51.56,16.51 | LED148.C 50.44,23.65 | LED149.C 50.32,32.16 51.82,33.66 | LED150.C 50.95,40.28 51.82,41.15 | 75.56,33.66 75.56,42.16 | 75.56,25.27 75.56,33.66 | 75.56,17.4 75.56,25.27 | 75.56,17.4 75.56,10.92 74.04,9.4 LED152.C 75.54,8.53 v75.95,8.51 | 75.56,42.16 75.56,46.89 LED157.C | LED156.C 74.04,40.64 75.06,41.66 | 75.06,41.66 75.56,42.16 | LED155.C 74.04,32.13 75.56,33.66 | LED154.C 74.07,23.77 75.56,25.27 | 75.56,17.4 74.19,16.03 LED153.C 74.04,17.4 v74.3,17.65 | LED163.C 96.5,47.9 97.16,47.24 97.16,41.66 | 97.16,25.4 97.16,17.4 | 97.16,32.89 97.16,25.4 | 97.16,41.66 97.16,32.89 | 97.16,17.4 97.16,17.27 | 97.16,17.27 97.16,9.68 LED158.C | LED159.C 96.04,16.15 97.16,17.4 | LED160.C 95.78,23.9 97.16,25.4 | LED161.C 96.29,31.9 97.16,32.89 | LED162.C 96.04,40.41 97.16,41.66
  Top 0.254: v73.91,42.55 75.06,41.66 | 51.82,19.94 51.31,19.3 v50.42,19.18 | v53.34,9.14 53.34,10.03 54.23,10.54 58.3,10.54 58.93,10.79 | 97.16,17.27 97.92,17.27 v98.17,16.76 | U$26.8 82.42,10.63 v82.42,10.41
  Top 0.406: C3.2 40.57,41.97 42.16,43.56 42.42,43.56 42.8,43.94 43.43,43.94 43.56,44.07 43.56,44.9 C2.2
  Bottom 0.254: C13.1 C12.1 41.15,11.43 45.47,11.43 47.5,13.34 47.5,16.89 49.78,19.18 v50.42,19.18 | JP2.1 24.49,7.49 v24.89,7.64 | v66.29,41.15 v73.91,42.55 | v98.17,16.76 98.68,14.99 SJ4.2 99.95,12.83 98.93,11.43 83.44,11.43 v82.42,10.41 80.52,8.51 v75.95,8.51 | v62.87,12.19 69.47,12.19 73.03,15.75 73.03,16.38 v74.3,17.65
  other vias: 37.78,12.45
  pour Bottom: 7.11,50.16 101.47,52.07 100.97,1.65 7.24,4.83
LED_SER1
  Bottom 0.254: U1.100 29.11,38.48 8.51,38.61 U$12.P$2
LED_SER2
  Bottom 0.254: U1.99 29.46,36.74 27.98,37.85 8.38,37.97 U$13.P$2
LED_SER3
  Bottom 0.254: U1.98 28.91,36.24 27.56,37.21 8.51,37.34 U$15.P$2
LED_SER4
  Bottom 0.254: U1.97 28.52,35.74 27.3,36.58 8.51,36.7 U$14.P$2
LED_SER5
  Bottom 0.254: U1.74 33.02,23.45 33.02,22.73 32.6,22.31 32.17,22.31 32.13,22.35 30.23,23.88 8.51,24 U$38.P$2
LED_SER6
  Bottom 0.254: U1.73 33.48,22.35 32.97,21.84 32.89,21.84 32.77,21.72 31.88,21.72 29.97,23.24 8.51,23.37 U$39.P$2
LED_SER7
  Bottom 0.254: U1.72 33.98,22.17 33.02,21.21 31.5,21.21 29.72,22.61 8.51,22.73 U$40.P$2
LED_SER8  (via drill 0.6)
  Top 0.254: U$26.14 78.11,17.6 78.11,19.43 76.71,20.83 v76.58,20.7 | v61.09,12.45 61.09,16.13 v60.96,16.26
  Bottom 0.254: v60.96,16.26 60.96,17.91 59.18,21.21 49.02,21.21 47.83,20.01 arc45 47.75,19.83 47.62,19.68 46.94,19 46.25,19.05 42.55,18.92 41.02,20.95 40.64,21.08 39.98,21.74 U1.60 | v76.58,20.7 75.44,19.81 75.44,12.95 71.88,12.95 70.36,11.43 70.36,7.24 69.72,6.6 61.85,6.6 61.09,7.62 v61.09,12.45
LED_SER9  (via drill 0.6)
  Top 0.254: U$27.14 12.7,22.17 12.7,24.13 14.48,25.91 17.78,25.91 20.45,24.38 20.45,22.61 v20.95,21.84
  Bottom 0.254: U1.71 34.48,22.04 33.15,20.7 31.37,20.7 30.86,20.83 30.75,20.94 29.61,21.95 29.21,22.1 22.35,22.1 22.1,21.84 v20.95,21.84
LED_SER10  (via drill 0.6)
  Top 0.254: U$28.14 30.52,14.84 30.48,14.88 30.48,16 29.72,16.76 v29.72,17.14
  Bottom 0.254: v29.72,17.14 29.72,16.87 29.95,19.48 30.42,20.19 33.27,20.19 34.98,21.9 U1.70
LED_SER11  (via drill 0.6)
  Top 0.254: U$29.14 55.67,15.83 55.24,16.38 55.24,18.03 v53.09,20.19
  Bottom 0.254: U1.61 39.48,21.35 40.26,20.45 40.77,20.32 42.16,18.41 47.12,18.41 49.28,20.57 52.7,20.57 v53.09,20.19
LED_SER12
  Bottom 0.254: 44.5,23.47 U1.51 46.35,23.49 47.24,24.38 52.58,24.38 53.85,25.65 100.71,25.65 | 100.71,25.65 101.09,25.65 | 100.71,25.65 U$46.P$2
LED_SER13
  Bottom 0.254: U1.58 40.98,22.65 41.15,22.35 41.66,22.1 43.31,20.19 46.23,20.19 49.15,22.73 54.36,22.73 55.3,23.67 arc-45 55.48,23.75 U$53.P$2
LED_SER14
  Bottom 0.254: 100.84,23.11 56.11,23.11 arc45 55.93,23.04 54.86,21.97 49.02,21.97 47.12,20.07 46.48,19.56 45.54,19.5 arc-45 45.49,19.56 42.93,19.56 41.4,21.46 40.89,21.72 40.48,22.13 U1.59 | 100.84,23.11 101.09,23.11 | 100.84,23.11 U$57.P$2
LED_SER15
  Bottom 0.254: U1.53 43.48,22.52 arc45 43.55,22.08 44.68,21.46 46.1,21.46 48.9,23.37 53.72,23.37 54.74,24.38 U$49.P$2
LED_SER16
  Bottom 0.254: U1.52 43.98,22.44 44.7,22.22 46.1,22.22 48.51,23.88 52.96,23.88 54.1,25.02 100.84,25.02 | 100.84,25.02 101.09,25.02 | 100.84,25.02 U$45.P$2
LED_SER17
  Bottom 0.254: U$63.P$2 95.76,30.1 95.4,29.74 U1.41
LED_SER18
  Bottom 0.254: U$62.P$2 96.01,29.46 95.79,29.24 U1.42
LED_SER19
  Bottom 0.254: U$61.P$2 101.06,28.74 U1.43
LED_SER20
  Bottom 0.254: U1.44 100.84,28.24 | 100.84,28.24 101.04,28.24 101.09,28.19 | 100.84,28.24 101.1,28.24 U$68.P$2
LED_SER21
  Bottom 0.254: 100.84,27.56 49.02,27.56 48.2,26.74 U1.47 | 100.84,27.56 101.09,27.56 | 100.84,27.56 U$67.P$2
LED_SER22
  Bottom 0.254: 100.84,26.92 50.29,26.92 49.61,26.24 U1.48 | 100.84,26.92 101.09,26.92 | 100.84,26.92 U$66.P$2
LED_SER23
  Bottom 0.254: 100.84,26.29 50.8,26.29 50.25,25.74 U1.49 | 100.84,26.29 101.09,26.29 | 100.84,26.29 U$65.P$2
N$1
  Top 0.254: C4.1 38.99,26.92 39.62,25.4 40.64,25.4 R25.1 R24.1
N$2
  Bottom 0.254: ICSP.5 52.32,46.74 45.97,46.74 43.98,44.49 U1.24
N$3
  Bottom 0.254: R7.2 69.22,49.02 71.12,47.12 75.82,47.12 PAD1.1
N$4
  Bottom 0.254: R8.2 55.75,49.78 PAD2.1
N$5
  Bottom 0.254: PAD3.1 32.89,48.9 34.16,47.24 36.9,47.24 R9.2
N$6
  Top 0.254: U$28.5 31.88,8.3 31.88,7.87 32.3,7.45 U$76.P$6
N$7
  Bottom 0.254: PAD4.1 8.76,48.13 9.4,48.26 11.24,48.26 R10.2
N$8
  Top 0.254: U$75.P$1 48.63,4.79 LED146.A
N$9
  Top 0.254: U$75.P$2 46.69,5.29 48.64,7.24 48.64,9.53 50.16,11.05 50.16,12.04 LED147.A
N$10
  Top 0.254: U$75.P$3 46.43,5.79 48.13,7.49 48.13,18.64 LED148.A
N$12  (via drill 0.6)
  Top 0.254: v32.38,28.45 32.96,27.69 C11.2
  Bottom 0.254: U1.85 31.88,29.74 v32.38,28.45
N$13  (via drill 0.6)
  Top 0.254: R24.2 43.81,36.07 | 43.81,36.07 v38.48,37.08 | 43.81,36.07 44.83,37.59 45.59,38.35 48.39,42.8 v50.67,42.8 | ICSP.1 60.96,42.67 59.82,40.26 54.1,40.26 v53.09,41.28
  Bottom 0.254: v38.48,37.08 U1.13 | v53.09,41.28 52.96,41.28 51.44,42.8 v50.67,42.8
N$14
  Bottom 0.254: U1.25 44.48,44.35 46.35,46.23 51.69,46.23 54.1,43.82 54.1,41.78 55.12,40.77 56.9,40.77 57.28,41.15 57.28,43.82 ICSP.4
N$15
  Top 0.254: U$75.P$4 46.17,6.29 47.62,7.75 47.62,23.62 50.29,26.29 LED149.A
N$17
  Top 0.254: U$76.P$1 45.94,6.95 47.12,8.26 47.12,24.38 49.02,26.29 49.02,33.4 50.16,34.54 50.16,37.31 LED150.A
N$18  (via drill 0.6)
  Top 0.254: U$76.P$2 45.55,7.45 46.61,8.51 46.61,24.89 48.51,26.67 48.51,34.42 49.02,34.93 v49.02,41.78 | v48.9,44.2 49.05,44.45 LED151.A
  Bottom 0.254: v49.02,41.78 49.02,42.42 v48.9,44.2
N$19
  Top 0.254: U$73.P$6 11.68,13.5 11.68,13.97 11.44,14.21 U$27.1
N$20
  Top 0.254: U$73.P$7 12.19,13.51 12.19,14.22 12.09,14.33 U$27.2
N$21
  Top 0.254: U$73.P$8 12.7,13.52 12.7,14.61 12.74,14.65 U$27.3
N$22
  Top 0.254: U$74.P$5 13.39,13.55 U$27.4
N$23
  Top 0.254: U$74.P$6 13.84,13.5 13.84,14.22 14.04,14.42 U$27.5
N$24
  Top 0.254: U$73.P$3 12.19,12.4 12.19,11.05 13.46,9.78 23.75,9.78 25.15,11.94 25.15,17.65 26.8,18.92 LED142.A
N$26
  Top 0.254: U$26.1 76.85,10.53 80.77,6.6 84.25,6.6 U$71.P$6
N$27
  Top 0.254: U$26.2 77.5,10.64 81.03,7.11 84.26,7.11 U$71.P$7
N$28
  Top 0.254: U$26.3 78.15,10.75 81.28,7.62 84.27,7.62 U$71.P$8
N$29
  Top 0.254: U$26.4 78.8,10.87 81.15,8.51 84.3,8.51 U$72.P$5
N$30
  Top 0.254: U$26.5 79.45,10.98 81.41,9.02 84.29,9.02 U$72.P$6
N$31
  Top 0.254: U$27.15 12.09,20.8 11.94,19.43 10.79,16.89 10.29,16.26 10.29,14.31 U$73.P$5
N$32
  Top 0.254: 26.8,5.21 LED140.A 24.54,4.93 21.08,8.38 12.95,8.38 11.05,10.41 11.05,12.37 U$73.P$1
N$33
  Top 0.254: LED141.A 26.8,10.41 25.27,9.02 13.34,9.02 11.68,10.67 11.68,12.41 U$73.P$2
N$34
  Top 0.254: U$71.P$3 92.02,7.18 93.85,9.02 93.85,16.76 95.63,18.54 LED160.A
N$35
  Top 0.254: LED143.A 26.67,28.57 24.13,27.05 24.13,12.07 23.11,10.41 13.72,10.41 12.7,11.43 12.7,12.39 U$73.P$4
N$36
  Top 0.254: U$29.1 54.37,7.63 54.36,7.62 55.67,5.8 U$77.P$6
N$37
  Bottom 0.254: R27.1 36.07,14.29 | Y1.P$2 38.61,15.88 36.07,14.29 | 36.07,14.29 C13.2
N$38
  Bottom 0.254: C12.2 42.8,13.21 Y1.P$1 41.91,17.78 41.02,18.16 R26.2 39.37,19.87 39.37,20.57 38.48,21.72 U1.63
N$39
  Top 0.254: U$29.2 54.99,9.22 54.99,7.87 56.19,6.3 U$77.P$7
N$40
  Top 0.254: U$29.3 55.63,9.2 55.63,8.13 56.58,6.8 U$77.P$8
N$41
  Top 0.254: U$29.4 56.26,9.19 56.26,8.26 56.81,7.46 U$78.P$5
N$42
  Top 0.254: U$29.5 57.02,9.19 57.02,8.26 57.32,7.96 U$78.P$6
N$43
  Top 0.254: U$77.P$2 71.84,5.8 72.77,6.73 72.77,10.54 74.04,11.81 LED153.A
N$44
  Top 0.254: U$77.P$3 71.32,6.3 72.26,7.24 72.26,17.02 73.91,18.67 73.91,20.8 LED154.A
N$45
  Top 0.254: U$77.P$4 71.06,6.8 71.75,7.62 71.75,19.43 72.64,20.19 72.64,25.02 73.91,26.29 73.91,28.8 LED155.A
N$46
  Top 0.254: LED144.A 26.8,35.18 25.4,34.54 25.4,28.96 23.24,27.69 23.24,12.45 22.35,11.05 13.97,11.05 13.34,11.68 13.34,12.42 U$74.P$1
N$47
  Top 0.254: LED145.A 26.8,43.05 25.4,42.42 25.4,35.69 24.89,35.05 24.89,29.46 22.48,27.94 22.48,12.95 21.72,11.81 14.1,11.81 13.84,12.07 13.84,12.41 U$74.P$2
N$62
  Top 0.254: U$28.1 29.21,8.34 29.21,6.73 30.65,5.29 U$75.P$6
N$63
  Top 0.254: U$28.2 29.84,8.33 29.84,7.11 31.17,5.79 U$75.P$7
N$64
  Top 0.254: U$28.3 30.48,8.31 30.48,7.49 31.68,6.29 U$75.P$8
N$74
  Top 0.254: 31.11,7.72 U$28.4 31.11,8.3 31.11,7.87 31.91,6.95 U$76.P$5
N$77
  Top 0.254: U$28.15 29.87,15.6 29.21,16.13 28.57,15.75 28.57,6.48 30.26,4.79 U$75.P$5
N$96
  Top 0.254: U$29.15 55.02,15.85 54.61,16.51 53.09,16.51 52.32,16 52.32,7.75 55.24,5.21 64.18,5.21 U$77.P$5
N$97
  Top 0.254: U$77.P$1 73.14,4.79 LED152.A
N$100
  Top 0.254: LED156.A 73.91,36.42 73.91,36.07 72.64,34.8 72.64,28.19 71.25,27.05 71.25,8.38 70.57,7.46 U$78.P$1
N$101
  Top 0.254: LED157.A 74.04,44.83 72.39,43.69 72.39,37.08 71.63,36.32 71.63,28.19 70.61,27.56 70.61,8.76 69.93,7.96 U$78.P$2
N$125
  Top 0.254: U$71.P$5 84.25,6.1 80.39,6.1 76.2,10.29 76.2,18.67 76.71,19.05 77.22,19.05 77.5,18.77 U$26.15
N$126
  Top 0.254: U$71.P$1 94.73,4.03 LED158.A
N$134
  Top 0.254: LED161.A 95.63,28.04 95.5,27.94 94.23,26.67 94.23,19.05 93.22,18.03 93.22,9.14 91.82,7.75 85.4,7.75 U$71.P$4
N$135
  Top 0.254: LED162.A 95.63,36.8 95.5,36.58 94.23,35.31 94.23,30.99 93.47,30.23 93.47,19.56 92.58,18.67 92.58,9.4 91.66,8.47 U$72.P$1
N$136
  Top 0.254: LED163.A 95.5,43.79 95.5,43.56 93.98,42.93 93.98,39.12 93.47,38.61 93.47,31.75 92.71,30.99 92.71,20.32 91.95,19.56 91.95,9.65 91.27,8.97 U$72.P$2
N$137
  Top 0.254: 95.63,12.55 LED159.A 95.63,10.29 94.36,9.78 94.36,8.64 92.41,6.68 U$71.P$2
OSC2
  Bottom 0.254: U1.64 37.97,22.85 37.97,22.48 38,21.88 38,21.49 R26.1 36.52,18.92 36.07,18.35 R27.2
P0_0
  Bottom 0.254: U1.82 27.89,28.24 27.43,28.32 8.51,28.45 U$32.P$2
P0_4
  Bottom 0.254: U1.3 33.48,39.93 33.27,40.13 8.51,39.88 U$10.P$2
P0_5
  Bottom 0.254: U1.83 28.15,28.74 27.56,28.96 8.51,29.08 U$31.P$2
P1_2
  Bottom 0.254: U$37.P$2 28.07,24.64 28.29,25.24 U1.76
P1_3
  Bottom 0.254: U1.77 27.52,25.74 27.18,25.15 8.51,25.27 U$41.P$2
P1_5
  Bottom 0.254: U1.1 31.98,39.12 8.51,39.24 U$11.P$2
P1_7
  Bottom 0.254: U1.84 28.42,29.24 27.69,29.59 8.51,29.72 U$30.P$2
P2_0
  Bottom 0.254: U$33.P$2 27.3,27.81 27.63,27.74 U1.81
P2_4
  Bottom 0.254: U$34.P$2 25.78,27.3 27.37,27.24 U1.80
P3_1
  Bottom 0.254: U1.11 37.48,44.82 37.08,44.83 8.51,44.96 U$1.P$2
P3_2
  Bottom 0.254: U1.10 36.98,44.05 36.45,44.2 8.64,44.32 U$4.P$2
P3_3
  Bottom 0.254: U1.9 36.48,43.28 35.81,43.56 8.51,43.69 U$3.P$2
P3_4
  Bottom 0.254: U1.8 35.98,42.51 35.18,42.93 8.51,43.05 U$6.P$2
P3_6
  Bottom 0.254: U1.7 35.48,41.73 34.54,42.29 8.51,42.42 U$5.P$2
P3_7
  Bottom 0.254: U1.6 34.98,40.97 33.91,41.66 8.51,41.78 U$7.P$2
RCK  (via drill 0.6)
  Top 0.254: v19.3,18.41 19.3,23.75 17.27,24.89 14.99,24.89 14.04,23.95 U$27.12 14.1,22.07 14.1,21.08 13.72,20.7 13.72,19.3 13.97,19.05 v13.97,18.29 | U$28.12 v31.82,17.53 31.82,18.6 30.86,19.56 30.35,19.56 v28.96,18.67 | v55.24,12.32 56.64,12.07 57.28,12.7 57.15,13.69 | 57.15,13.69 U$29.12 | 57.15,13.69 56.9,15.75 56.9,18.29 58.93,20.45 61.47,20.45 63.5,22.48 68.71,22.48 v69.6,21.59 | U$26.12 79.45,16.44 80.39,16 v84.45,16 84.58,17.02 86.36,18.8 v86.36,21.72
  Bottom 0.254: v19.3,18.41 20.32,19.43 27.43,19.43 28.57,18.54 v28.96,18.67 | U1.68 35.98,21.5 33.66,19.18 32.46,18.41 v31.82,17.53 31.82,10.47 33.15,9.65 47.24,9.65 50.29,13.08 54.61,13.08 v55.24,12.32 | v69.6,21.59 74.42,21.59 75.18,22.35 85.85,22.35 v86.36,21.72 | v13.97,18.29 12.45,19.68 10.16,19.68 9.02,20.45 8.98,20.49 8.98,20.52 8.67,20.83 U$79.P$2 | U$83.P$2 89.53,21.21 84.58,16 v84.45,16
RST_N
  Bottom 0.254: U1.78 26.84,26.24 26.42,25.78 8.51,25.91 U$36.P$2
RXD  (1 unrouted)
  Bottom 0.254: U1.14 38.98,45.35 37.72,46.1 8.51,46.23 RXD.P$1
SCK  (via drill 0.6)  (2 unrouted)
  Top 0.254: U$28.11 32.47,16.51 v33.02,17.78 32.89,18.8 31.88,19.81 29.84,20.57 v29.08,19.94 | v58.29,12.95 58.04,13.08 57.66,15.18 U$29.11 57.62,17.23 v57.78,17.4 | v80.14,19.43 80.14,18.92 80.1,18.63 U$26.11 | v18.41,19.56 18.41,23.49 17.02,24.38 15.24,24.38 14.69,23.83 U$27.11 14.69,20.41 v14.61,20.07
  Bottom 0.254: v18.41,19.56 19.3,20.32 27.43,20.32 v29.08,19.94 | U1.67 36.48,21.37 35.31,20.07 34.04,18.8 33.78,18.41 v33.02,17.78 32.93,14.19 32.89,13.98 32.89,10.67 34.04,10.29 46.86,10.29 49.02,12.45 49.02,15.49 49.78,16.89 50.16,17.4 52.45,17.91 56.9,17.91 57.4,17.4 v57.78,17.4 | v58.29,12.95 58.42,6.22 59.18,5.46 71.02,5.46 71.51,5.96 71.63,10.67 72.64,11.68 76.45,11.68 76.71,11.94 76.71,18.67 78.36,19.94 79.5,19.94 79.88,19.81 v80.14,19.43 80.9,18.67 82.68,18.67 84.71,20.7 86.87,20.7 88.65,22.48 U$81.P$2 | U$42.P$1 9.02,22.1 10.67,20.83 12.83,20.83 v14.61,20.07
SCLR  (via drill 0.6)
  Top 0.254: 58.29,15.68 U$29.10 58.29,15.17 58.29,16.26 58.74,16.71 59.6,16.71 | U$26.10 80.77,17.58 80.77,18.54 81.28,18.92 v81.79,19.81 82.8,19.18 v82.93,17.78 | v29.08,21.21 29.97,21.59 31.88,20.57 33.27,19.81 34.16,18.16 v33.91,16.89 33.07,15.44 33.07,14.34 arc45 33.12,14.22 U$28.10 | v17.4,20.95 17.4,23.11 16.64,23.75 15.88,23.75 15.49,23.37 U$27.10 15.34,20.6 v16,19.81 | 59.6,16.71 59.94,16.36 v59.94,13.46 | v59.44,18.03 59.6,17.87 59.6,16.71
  Bottom 0.254: v59.44,18.03 58.8,18.67 51.82,18.67 49.53,17.78 48.39,15.75 48.39,12.95 46.48,10.92 34.42,10.92 33.78,11.05 33.78,15.88 v33.91,16.89 34.29,17.53 34.8,18.8 36.96,21.08 36.98,21.11 U1.66 36.96,23.49 | v81.79,19.81 81.53,19.81 80.52,20.7 78.23,20.7 75.95,18.92 75.95,12.45 72.39,12.45 70.87,10.79 70.87,6.6 70.36,6.1 60.45,6.1 59.82,6.73 v59.94,13.46 | v17.4,20.95 26.18,20.95 27.84,21.23 v29.08,21.21 | U$2.P$2 9.02,21.34 10.41,20.32 12.57,20.32 13.84,19.43 14.48,19.18 15.24,19.18 v16,19.81 | U$82.P$2 89.15,21.84 87.25,19.94 84.96,19.94 82.93,17.91 v82.93,17.78
STRING1
  Bottom 0.254: U1.96 28.13,35.24 26.92,35.94 8.51,36.07 U$16.P$2
STRING2
  Bottom 0.254: U1.95 27.87,34.74 26.92,35.31 8.51,35.43 U$17.P$2
STRING3
  Bottom 0.254: U1.94 27.35,34.24 26.54,34.67 8.51,34.8 U$19.P$2
STRING4
  Bottom 0.254: U1.89 30.72,31.75 29.59,31.75 29.46,31.62 U$23.P$2
STRING5  (1 unrouted)
STRING6  (1 unrouted)
  Bottom 0.254: U1.87 30.34,30.73 | 8.51,30.35 U$25.P$2
SW_BTN
  Bottom 0.254: U$9.P$2 33.4,40.64 33.98,40.19 U1.4
TXD  (1 unrouted)
  Bottom 0.254: U1.12 37.98,45.2 37.34,45.47 8.51,45.59 U$44.P$1
VDD  (via drill 0.6)  (2 unrouted)
  Top 0.254: C9.2 C8.1 C10.1 33.15,30.93 33.15,35.56 | 33.15,35.56 v32.64,35.81 | 33.15,35.56 34.67,36.32 C6.1 C5.2 38.73,35.49 v40.51,35.56 42.55,34.93 42.55,30.92 R25.2 | v28.96,30.1 29.08,27.65 C7.1 | SJ1.2 10.03,17.27 11.18,19.56 11.43,20.45 11.44,20.82 U$27.16 11.43,24.13 14.1,26.8 19.05,26.8 | U$28.16 29.22,12.82 29.34,12.7 29.34,11.68 v29.59,11.43 | U$26.16 76.85,16.12 78.11,13.84 v80.64,13.84 | 19.05,26.8 21.97,23.88 21.97,20.07 21.59,19.68 v21.59,18.16 | v98.17,19.43 99.06,18.54 SJ2.2 | U$29.16 54.21,14.99 v53.34,14.99 v53.34,11.3 | v43.69,21.08 44.96,19.81 44.96,9.02 v44.2,8.26 | v20.7,30.61 19.05,28.96 19.05,26.8 | v48.01,35.18 48.01,34.93 47.75,34.67 v47.75,32
  Top 0.406: v28.96,30.1 29.08,32.39 29.92,33.48 U2.4 U2.2 37.13,41.02 37.47,41.02 38.61,39.88 C3.1 38.61,39.81 38.61,38.61 39.12,38.1 41.66,38.1 44.83,41.28 v45.34,41.28 | D140.P$2 45.99,47.73 47.75,45.97 47.75,45.09 46.86,44.2 46.23,44.2 v46.1,44.07
  Bottom 0.254: v40.51,35.56 39.98,36.58 U1.16 | U1.86 | v40.51,35.56 40.51,27.18 | 40.51,27.18 46.23,27.18 U1.46 | 40.77,25.91 42.48,25.27 U1.55 42.55,23.43 42.55,22.22 v43.69,21.08 | 40.77,25.91 38.98,25.27 U1.62 | 40.51,27.18 40.77,25.91 | v40.51,35.56 44.07,35.56 44.32,35.31 46.17,35.31 U1.30 46.29,35.31 47.24,35.31 47.5,35.18 v48.01,35.18 | U1.86 32.02,30.24 32.51,30.73 32.51,35.69 v32.64,35.81 32.64,36.7 32.98,37.05 U1.2 | U1.86 29.1,30.24 v28.96,30.1 28.45,30.61 v20.7,30.61 | U1.37 47.24,31.74 v47.75,32 | v80.64,13.84 84.2,13.84 84.58,14.22 87.76,14.22 92.96,19.43 v98.17,19.43 | v21.59,18.16 21.97,18.54 27.3,18.54 28.57,17.27 28.57,16.51 29.59,15.49 v29.59,11.43 | v53.34,14.99 53.47,15.11 62.87,15.11 64.01,13.97 69.6,13.97 73.03,17.4 73.03,20.57 73.41,20.95 75.18,20.95 75.95,21.72 77.6,21.72 78.36,21.34 v82.8,21.34 | v53.34,11.3 52.7,11.05 51.94,10.29 51.94,4.83 51.31,4.32 48.13,4.32 v44.2,8.26
  Bottom 0.406: v46.1,44.07 46.1,42.8 45.47,42.16 45.47,41.4 v45.34,41.28
  pour Top: 7.62,50.04 7.62,4.83 100.97,1.52 101.09,51.82
VSS  (via drill 0.6)
  Top 0.254: v39.62,34.29 C5.1 | v39.62,34.29 C9.1 | v39.62,34.29 v41.53,34.29 | C5.1 C6.2 C10.2 C8.2 C5.1 | C7.2 30.89,24.73 v31.62,23.88
  Bottom 0.254: 44.32,33.66 v41.53,34.29 | 44.32,32.26 44.32,33.66 | 44.32,32.26 44.32,28.32 44.96,27.69 U1.45 | U1.15 39.48,36.32 v39.62,34.29 37.47,33.02 37.47,28.7 37.48,28.45 37.48,25.77 | 37.48,25.77 U1.65 | 37.48,25.77 36.32,26.29 33.24,26.29 32.48,25.53 U1.75 31.97,23.49 v31.62,23.88 | U1.36 44.34,32.24 44.32,32.26 | U1.31 44.65,34.74 44.32,34.42 44.32,33.66
WAKEUP
  Bottom 0.254: U$8.P$2 33.66,41.15 34.42,40.7 34.48,40.64 U1.5

### Text on the board
tPlace: AMP PIN | ECE 477 Team 12 / Guitutar